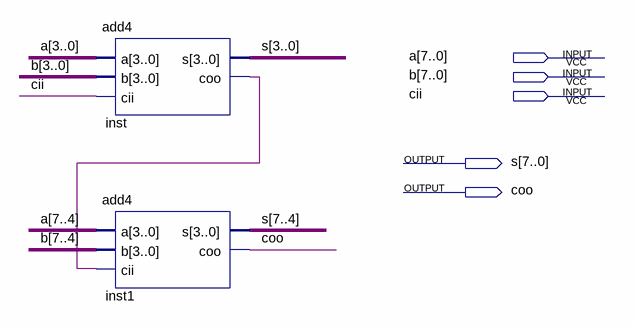
[diagram p0: schematic sheet]
// Quartus schematic add8.bdf as structural Verilog: 2 symbols, 5 pins
module add8 (
  input  [7:0] a,
  input  [7:0] b,
  input  cii,
  output [7:0] s,
  output coo
);

  wire inst_coo;

  add4 inst (.a(a[3:0]), .b(b[3:0]), .cii(cii), .s(s[3:0]), .coo(inst_coo));
  add4 inst1 (.a(a[7:4]), .b(b[7:4]), .cii(inst_coo), .s(s[7:4]), .coo(coo));
endmodule
